# EAGLE design Ulimate (EAGLE 7.2.0)
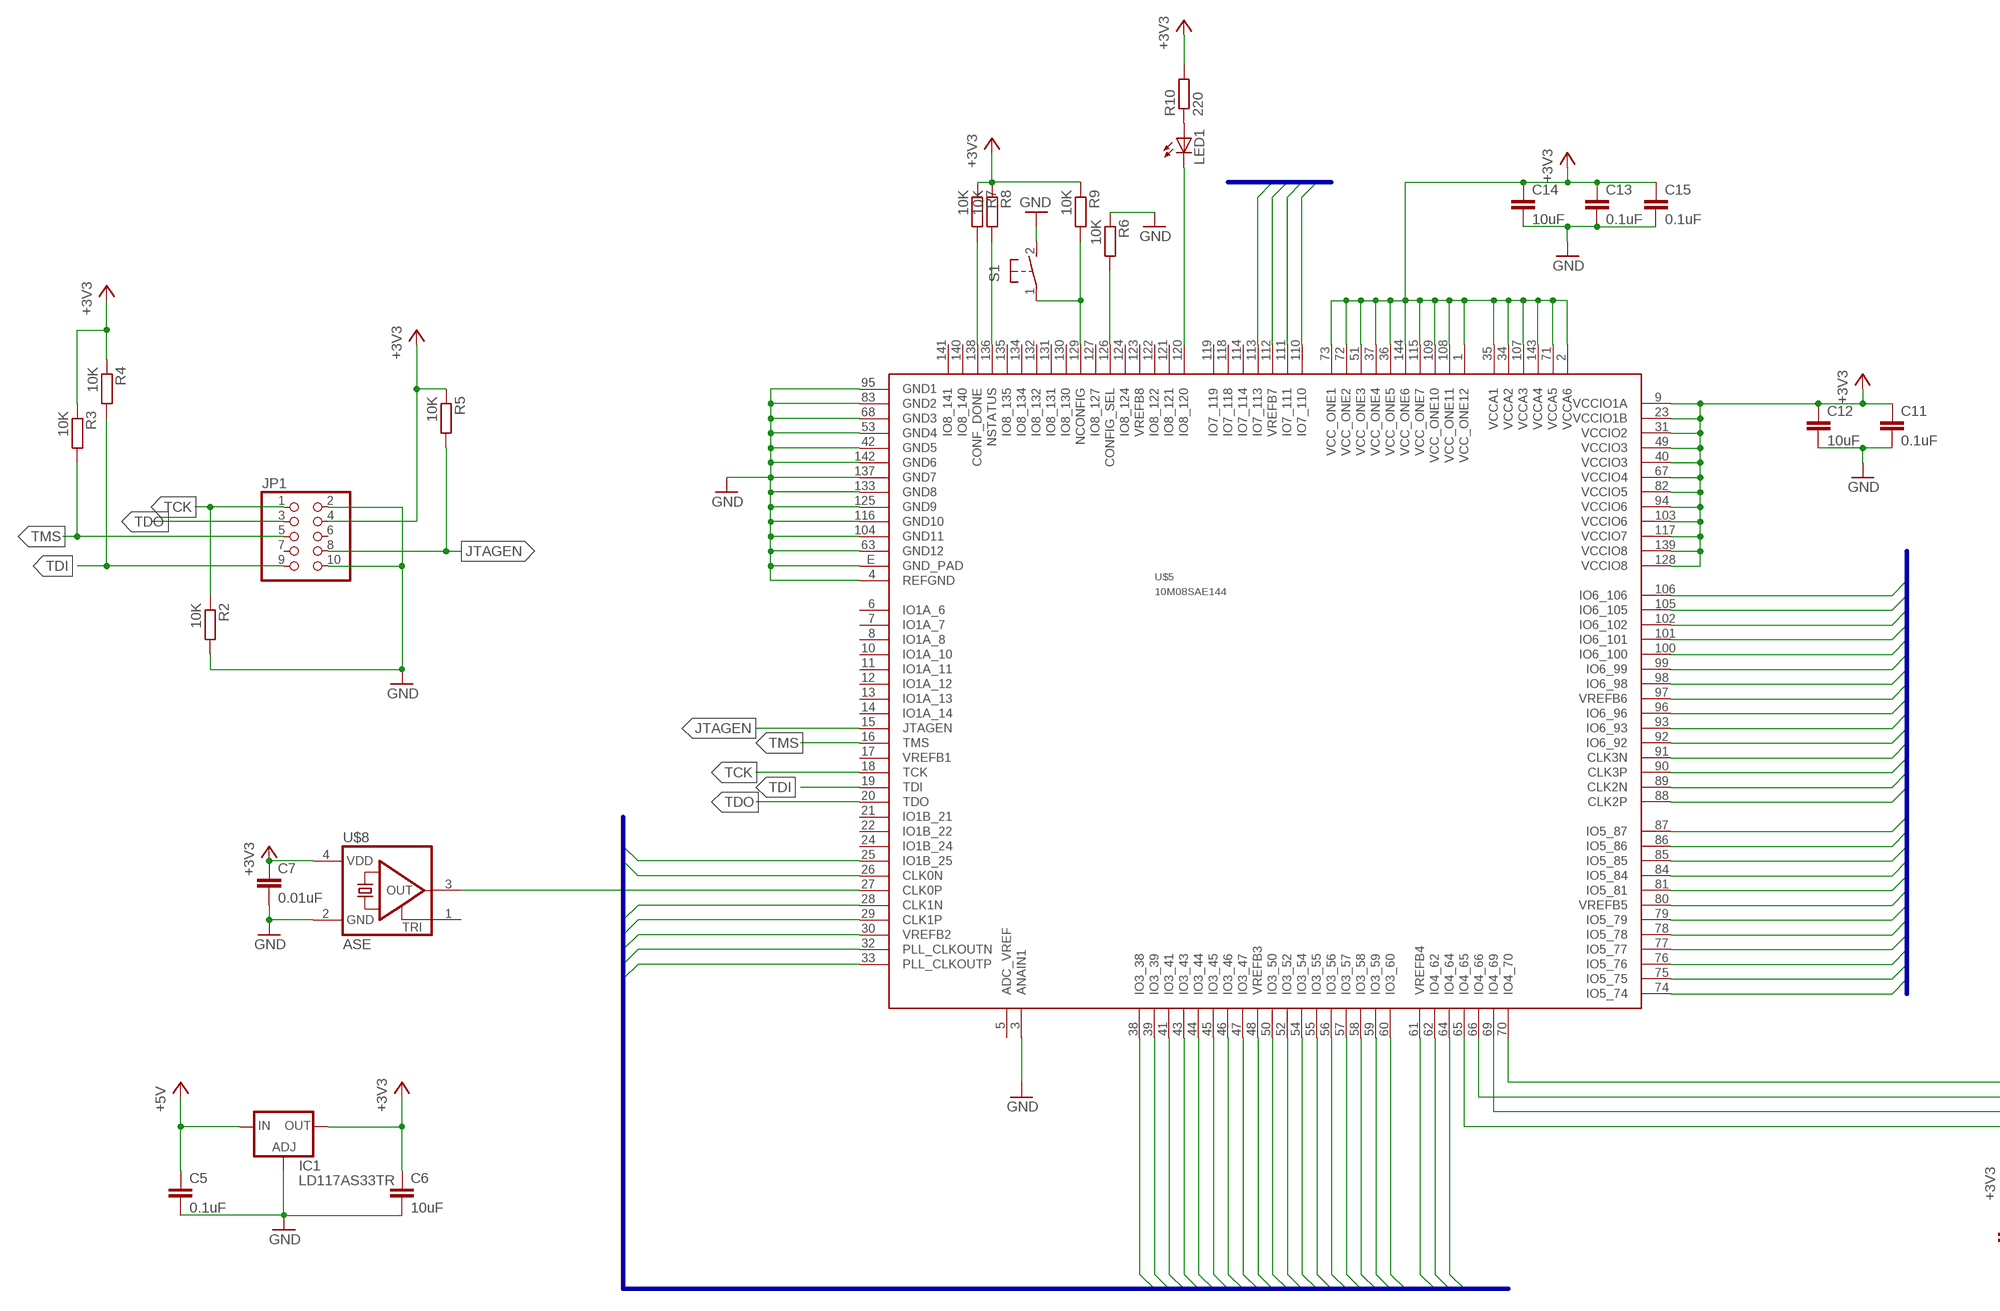
[diagram p0: schematic, sheet 1, part 1 of 2]
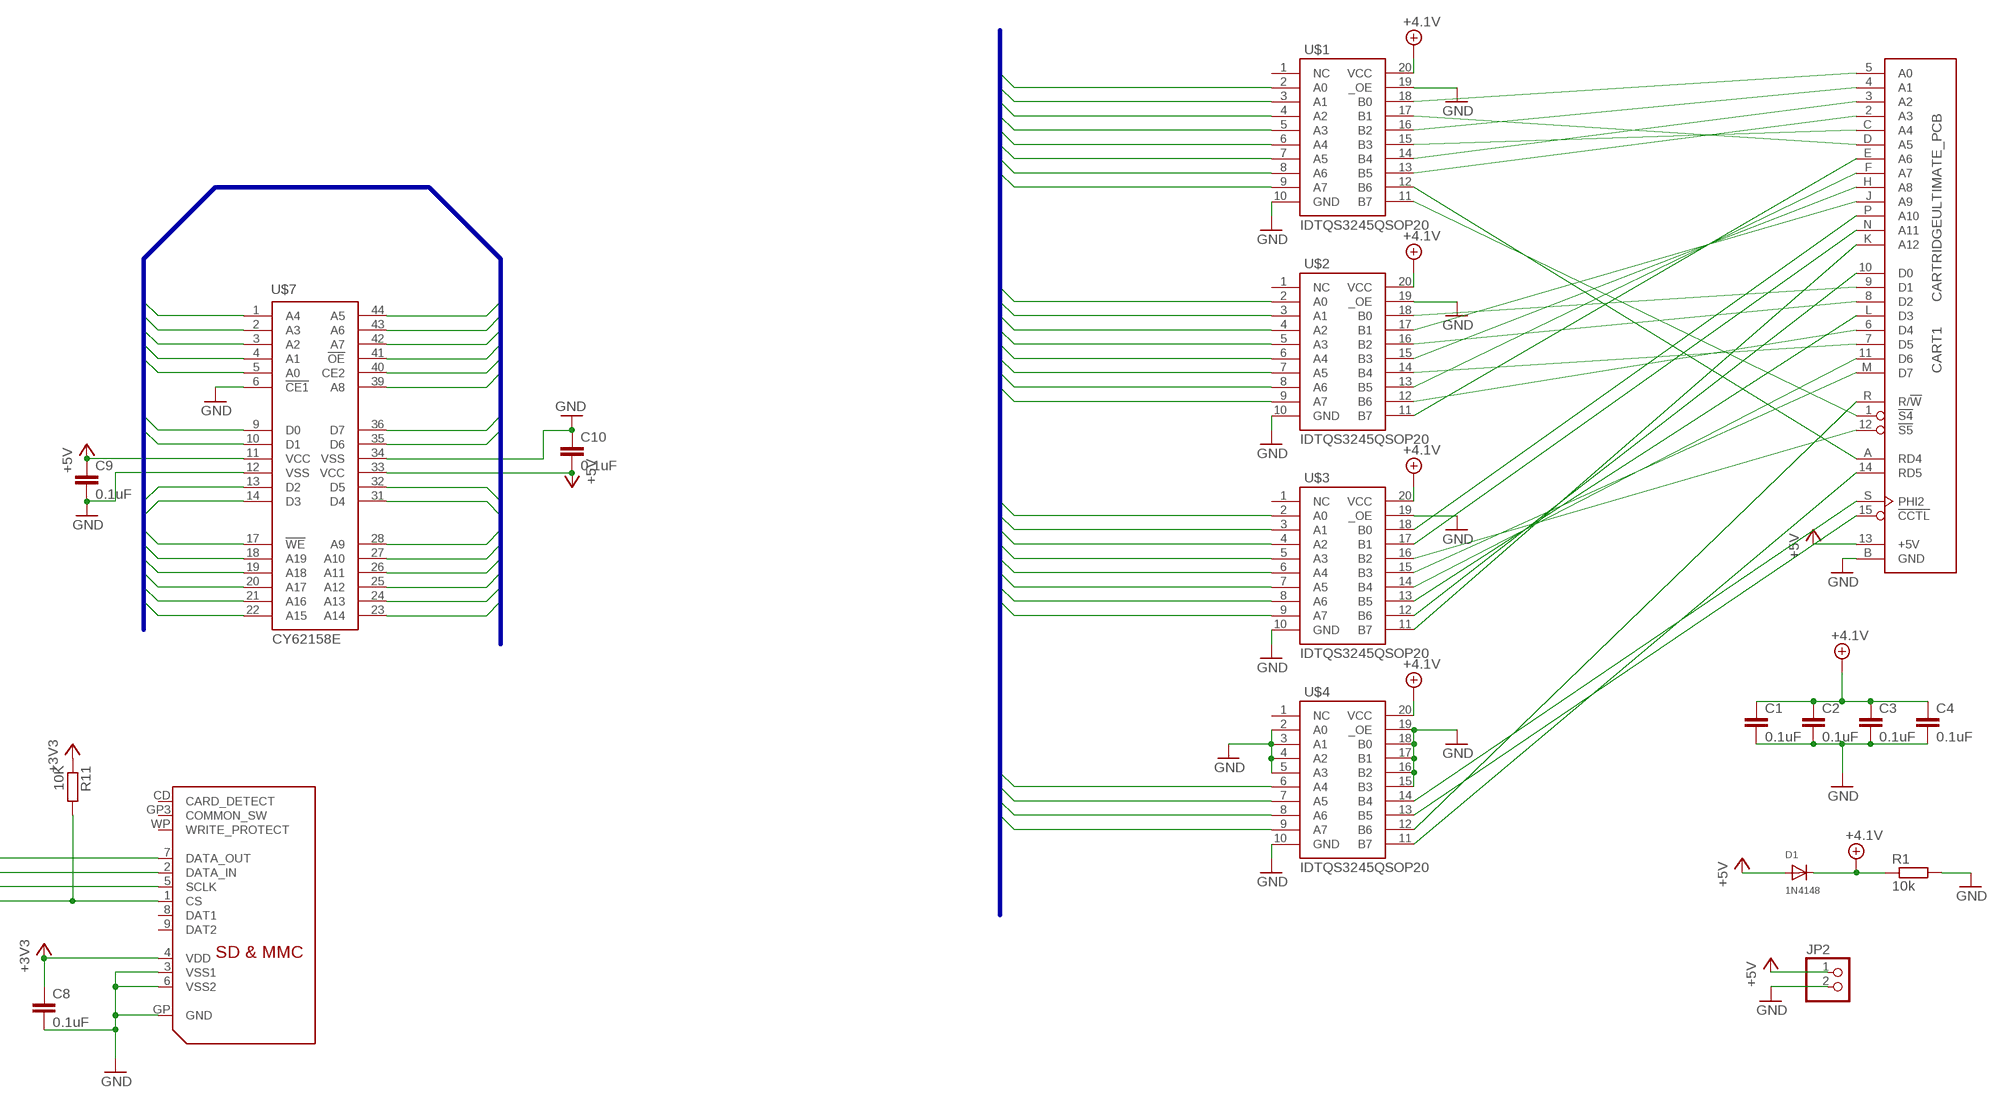
[diagram p1: schematic, sheet 1, part 2 of 2]

## Parts
C1  0.1uF  C-EUC0805K  [C0805K]
C2  0.1uF  C-EUC0805K  [C0805K]
C3  0.1uF  C-EUC0805K  [C0805K]
C4  0.1uF  C-EUC0805K  [C0805K]
C5  0.1uF  C-EUC0805K  [C0805K]
C6  10uF  C-EUC0805K  [C0805K]
C7  0.01uF  C-EUC0805K  [C0805K]
C8  0.1uF  C-EUC0805K  [C0805K]
C9  0.1uF  C-EUC0805K  [C0805K]
C10  0.1uF  C-EUC0805K  [C0805K]
C11  0.1uF  C-EUC0805K  [C0805K]
C12  10uF  C-EUC0805K  [C0805K]
C13  0.1uF  C-EUC0805K  [C0805K]
C14  10uF  C-EUC0805K  [C0805K]
C15  0.1uF  C-EUC0805K  [C0805K]
CART1  CARTRIDGEULTIMATE_PCB  [CART_ULTIMATE]
D1  1N4148  DIODE_SOD-123FL  [SOD-123FL]
IC1  LD117AS33TR  [SOT223]
JP1  PINHD-2X5  [2X05]
JP2  PINHD-1X2  [1X02]
LED1  LEDSML0805  [SML0805]
R1  10k  R-EU_R0805  [R0805]
R2  10K  R-EU_R0805  [R0805]
R3  10K  R-EU_R0805  [R0805]
R4  10K  R-EU_R0805  [R0805]
R5  10K  R-EU_R0805  [R0805]
R6  10K  R-EU_R0805  [R0805]
R7  10K  R-EU_R0805  [R0805]
R8  10K  R-EU_R0805  [R0805]
R9  10K  R-EU_R0805  [R0805]
R10  220  R-EU_R0805  [R0805]
R11  10K  R-EU_R0805  [R0805]
S1  31-XXSKINNY  [B3F-31XX-SKINNIER]
U$1  IDTQS3245QSOP20  [QSOP20]
U$2  IDTQS3245QSOP20  [QSOP20]
U$3  IDTQS3245QSOP20  [QSOP20]
U$4  IDTQS3245QSOP20  [QSOP20]
U$5  10M08SAE144  [EQFP144]
U$6  SDMMC06132  [06132]
U$7  CY62158E  [TSOP44-II]
U$8  ASE  [ASE]

## Nets
!OE: U$5.106(IO6_106) U$7.41(!OE)
!WE: U$5.89(CLK2N) U$7.17(!WE)
+3V3: C6.1 C7.1 C8.1 C11.1 C12.1 C13.1 C14.1 C15.1 IC1.4(OUT) JP1.4 R3.1 R4.1 R5.1 R7.1 R8.1 R9.1 R10.2 R11.1 U$5.1(VCC_ONE12) U$5.2(VCCA6) U$5.9(VCCIO1A) U$5.23(VCCIO1B) U$5.31(VCCIO2) U$5.34(VCCA2) U$5.35(VCCA1) U$5.36(VCC_ONE5) U$5.37(VCC_ONE4) U$5.40(VCCIO3) U$5.49(VCCIO3) U$5.51(VCC_ONE3) U$5.67(VCCIO4) U$5.71(VCCA5) U$5.72(VCC_ONE2) U$5.73(VCC_ONE1) U$5.82(VCCIO5) U$5.94(VCCIO6) U$5.103(VCCIO6) U$5.107(VCCA3) U$5.108(VCC_ONE11) U$5.109(VCC_ONE10) U$5.115(VCC_ONE7) U$5.117(VCCIO7) U$5.128(VCCIO8) U$5.139(VCCIO8) U$5.143(VCCA4) U$5.144(VCC_ONE6) U$6.4(VDD) U$8.4(VDD)
+4.1V: C1.1 C2.1 C3.1 C4.1 D1.C R1.1 U$1.20(VCC) U$2.20(VCC) U$3.20(VCC) U$4.20(VCC)
+5V: C5.1 C9.1 C10.2 CART1.13(+5V) D1.A IC1.3(IN) JP2.1 U$7.11(VCC) U$7.33(VCC)
A0: U$5.96(IO6_96) U$7.5(A0)
A1: U$5.97(VREFB6) U$7.4(A1)
A2: U$5.98(IO6_98) U$7.3(A2)
A3: U$5.99(IO6_99) U$7.2(A3)
A4: U$5.100(IO6_100) U$7.1(A4)
A5: U$5.105(IO6_105) U$7.44(A5)
A6: U$5.102(IO6_102) U$7.43(A6)
A7: U$5.101(IO6_101) U$7.42(A7)
A8: U$5.111(IO7_111) U$7.39(A8)
A9: U$5.76(IO5_76) U$7.28(A9)
A10: U$5.77(IO5_77) U$7.27(A10)
A11: U$5.78(IO5_78) U$7.26(A11)
A12: U$5.79(IO5_79) U$7.25(A12)
A13: U$5.80(VREFB5) U$7.24(A13)
A14: U$5.81(IO5_81) U$7.23(A14)
A15: U$5.84(IO5_84) U$7.22(A15)
A16: U$5.85(IO5_85) U$7.21(A16)
A17: U$5.86(IO5_86) U$7.20(A17)
A18: U$5.87(IO5_87) U$7.19(A18)
A19: U$5.88(CLK2P) U$7.18(A19)
CART_A0: U$1.2(A0) U$5.39(IO3_39)
CART_A1: U$1.4(A2) U$5.33(PLL_CLKOUTP)
CART_A2: U$1.6(A4) U$5.30(VREFB2)
CART_A3: U$1.7(A5) U$5.29(CLK1P)
CART_A4: U$1.5(A3) U$5.32(PLL_CLKOUTN)
CART_A5: U$1.3(A1) U$5.38(IO3_38)
CART_A6: U$2.9(A7) U$5.41(IO3_41)
CART_A7: U$2.7(A5) U$5.44(IO3_44)
CART_A8: U$2.5(A3) U$5.46(IO3_46)
CART_A9: U$2.3(A1) U$5.48(VREFB3)
CART_A10: U$3.2(A0) U$5.60(IO3_60)
CART_A11: U$3.3(A1) U$5.59(IO3_59)
CART_A12: U$3.9(A7) U$5.52(IO3_52)
CART_CTL: U$4.7(A5) U$5.64(IO4_64)
CART_D0: U$3.8(A6) U$5.54(IO3_54)
CART_D1: U$2.2(A0) U$5.50(IO3_50)
CART_D2: U$2.4(A2) U$5.47(IO3_47)
CART_D3: U$3.7(A5) U$5.55(IO3_55)
CART_D4: U$2.8(A6) U$5.43(IO3_43)
CART_D5: U$2.6(A4) U$5.45(IO3_45)
CART_D6: U$3.6(A4) U$5.56(IO3_56)
CART_D7: U$3.5(A3) U$5.57(IO3_57)
CART_PHI: U$4.6(A4) U$5.26(CLK0N)
CART_RD4: U$1.8(A6) U$5.25(IO1B_25)
CART_RD5: U$4.9(A7) U$5.61(VREFB4)
CART_RW: U$4.8(A6) U$5.62(IO4_62)
CART_S4: U$1.9(A7) U$5.28(CLK1N)
CART_S5: U$3.4(A2) U$5.58(IO3_58)
CE: U$5.110(IO7_110) U$7.40(CE2)
D0: U$5.93(IO6_93) U$7.9(D0)
D1: U$5.92(IO6_92) U$7.10(D1)
D2: U$5.91(CLK3N) U$7.13(D2)
D3: U$5.90(CLK3P) U$7.14(D3)
D4: U$5.75(IO5_75) U$7.31(D4)
D5: U$5.74(IO5_74) U$7.32(D5)
D6: U$5.113(IO7_113) U$7.35(D6)
D7: U$5.112(VREFB7) U$7.36(D7)
GND: C1.2 C2.2 C3.2 C4.2 C5.2 C6.2 C7.2 C8.2 C9.2 C10.1 C11.2 C12.2 C13.2 C14.2 C15.2 CART1.B(GND) IC1.1(ADJ) JP1.2 JP1.10 JP2.2 R1.2 R2.2 R6.1 S1.2(S) U$1.10(GND) U$1.19(_OE) U$2.10(GND) U$2.19(_OE) U$3.10(GND) U$3.19(_OE) U$4.2(A0) U$4.3(A1) U$4.4(A2) U$4.5(A3) U$4.10(GND) U$4.15(B3) U$4.16(B2) U$4.17(B1) U$4.18(B0) U$4.19(_OE) U$5.3(ANAIN1) U$5.4(REFGND) U$5.42(GND5) U$5.53(GND4) U$5.63(GND12) U$5.68(GND3) U$5.83(GND2) U$5.95(GND1) U$5.104(GND11) U$5.116(GND10) U$5.125(GND9) U$5.133(GND8) U$5.137(GND7) U$5.142(GND6) U$5.E(GND_PAD) U$6.3(VSS1) U$6.6(VSS2) U$6.GP(GND) U$7.6(!CE1) U$7.12(VSS) U$7.34(VSS) U$8.2(GND)
JTAGEN: JP1.8 R5.2 U$5.15(JTAGEN)
N$1: CART1.1(!S4) U$1.11(B7)
N$2: CART1.A(RD4) U$1.12(B6)
N$3: CART1.2(A3) U$1.13(B5)
N$4: CART1.3(A2) U$1.14(B4)
N$5: CART1.C(A4) U$1.15(B3)
N$6: CART1.4(A1) U$1.16(B2)
N$7: CART1.D(A5) U$1.17(B1)
N$8: CART1.5(A0) U$1.18(B0)
N$9: CART1.E(A6) U$2.11(B7)
N$10: CART1.6(D4) U$2.12(B6)
N$11: CART1.F(A7) U$2.13(B5)
N$12: CART1.7(D5) U$2.14(B4)
N$13: CART1.H(A8) U$2.15(B3)
N$14: CART1.8(D2) U$2.16(B2)
N$15: CART1.J(A9) U$2.17(B1)
N$16: CART1.9(D1) U$2.18(B0)
N$17: CART1.K(A12) U$3.11(B7)
N$18: CART1.10(D0) U$3.12(B6)
N$19: CART1.L(D3) U$3.13(B5)
N$20: CART1.11(D6) U$3.14(B4)
N$21: CART1.M(D7) U$3.15(B3)
N$22: CART1.12(!S5) U$3.16(B2)
N$23: CART1.N(A11) U$3.17(B1)
N$24: CART1.P(A10) U$3.18(B0)
N$25: CART1.14(RD5) U$4.11(B7)
N$26: CART1.R(R/!W) U$4.12(B6)
N$27: CART1.15(!CCTL) U$4.13(B5)
N$28: CART1.S(PHI2) U$4.14(B4)
N$29: U$5.27(CLK0P) U$8.3(OUT)
N$30: R6.2 U$5.126(CONFIG_SEL)
N$31: R7.2 U$5.138(CONF_DONE)
N$32: R8.2 U$5.136(NSTATUS)
N$33: R9.2 S1.1(P) U$5.129(NCONFIG)
N$34: LED1.A R10.1
N$35: LED1.C U$5.120(IO8_120)
SD_CLK: U$5.69(IO4_69) U$6.5(SCLK)
SD_CS: R11.2 U$5.65(IO4_65) U$6.1(CS)
SD_DI: U$5.66(IO4_66) U$6.2(DATA_IN)
SD_DO: U$5.70(IO4_70) U$6.7(DATA_OUT)
TCK: JP1.1 R2.1 U$5.18(TCK)
TDI: JP1.9 R4.2 U$5.19(TDI)
TDO: JP1.3 U$5.20(TDO)
TMS: JP1.5 R3.2 U$5.16(TMS)
Unconnected: JP1.6 JP1.7 U$1.1(NC) U$2.1(NC) U$3.1(NC) U$4.1(NC) U$5.5(ADC_VREF) U$5.6(IO1A_6) U$5.7(IO1A_7) U$5.8(IO1A_8) U$5.10(IO1A_10) U$5.11(IO1A_11) U$5.12(IO1A_12) U$5.13(IO1A_13) U$5.14(IO1A_14) U$5.17(VREFB1) U$5.21(IO1B_21) U$5.22(IO1B_22) U$5.24(IO1B_24) U$5.114(IO7_114) U$5.118(IO7_118) U$5.119(IO7_119) U$5.121(IO8_121) U$5.122(IO8_122) U$5.123(VREFB8) U$5.124(IO8_124) U$5.127(IO8_127) U$5.130(IO8_130) U$5.131(IO8_131) U$5.132(IO8_132) U$5.134(IO8_134) U$5.135(IO8_135) U$5.140(IO8_140) U$5.141(IO8_141) U$6.8(DAT1) U$6.9(DAT2) U$6.CD(CARD_DETECT) U$6.GP3(COMMON_SW) U$6.WP(WRITE_PROTECT) U$8.1(TRI)

## Buses
CART_D[0..7],CART_A[0..12],CART_S4,CART_S5,CART_RD4,CART_RD5,CART_RW,CART_PHI,CART_CTL
D[0..7],A[0..19],CE,!WE,!OE

## Library data of the parts
C1-C15 = rcl:C-EU: CAPACITOR, European symbol
CART1 = eagle-6.5.0-atari:CARTRIDGE: Cartridge
D1 = adafruit:DIODE: Diode SMADIODE - SMA Surface Mount Package 20V 1A Schottky Diode Digikey: 641-1014-6-ND DO-1N4148 - Through Hole Small Current Diode SOD-123 20V 1 A (.5mV Vf) Schottky Diode - Digikey: MBRX120TPMSCT-ND SOD-323 10V 570mA (.38mV Vf, 3ns) Schottky Diode - Digikey: ZLLS410CT-ND SOD-523 30V 30mA Schottky Diode (RB751S-40TE61) - Digikey: RB751S-40TE61CT-ND SOT23-R/W - SOT23 Package (R = Solder Paste/Reflow Ovens, W = Hand-Soldering) BAT54Film 40V 300mA - Digikey: 497-7162-1-ND
IC1 = v-reg:LD117A?*: Low drop fixed and adjustable positive voltage regulators 1 A Source: http://www.st.com/stonline/products/literature/ds/7194/ld1117axx.pdf
JP1 = pinhead:PINHD-2X5: PIN HEADER
JP2 = pinhead:PINHD-1X2: PIN HEADER
LED1 = led:LED: LED OSRAM: - CHIPLED LG R971, LG N971, LY N971, LG Q971, LY Q971, LO R971, LY R971 LH N974, LH R974 LS Q976, LO Q976, LY Q976 LO Q996 - Hyper CHIPLED LW Q18S LB Q993, LB Q99A, LB R99A - SideLED LS A670, LO A670, LY A670, LG A670, LP A670 LB A673, LV A673, LT A673, LW A673 LH A674 LY A675 LS A676, LA A676, LO A676, LY A676, LW A676 LS A679, LY A679, LG A679 - Hyper Micro SIDELED® LS Y876, LA Y876, LO Y876, LY Y876 LT Y87S - SmartLED LW L88C, LW L88S LB L89C, LB L89S, LG L890 LS L89K, LO L89K, LY L89K LS L896, LA L896, LO L896, LY L896 - TOPLED LS T670, LO T670, LY T670, LG T670, LP T670 LSG T670, LSP T670, LSY T670, LOP T670, LYG T670 LG T671, LOG T671, LSG T671 LB T673, LV T673, LT T673, LW T673 LH T674 LS T676, LA T676, LO T676, LY T676, LB T676, LH T676, LSB T676, LW T676 LB T67C, LV T67C, LT T67C, LS T67K, LO T67K, LY T67K, LW E67C LS E67B, LA E67B, LO E67B, LY E67B, LB E67C, LV E67C, LT E67C LW T67C LS T679, LY T679, LG T679 LS T770, LO T770, LY T770, LG T770, LP T770 LB T773, LV T773, LT T773, LW T773 LH T774 LS E675, LA E675, LY E675, LS T675 LS T776, LA T776, LO T776, LY T776, LB T776 LHGB T686 LT T68C, LB T68C - Hyper Mini TOPLED® LB M676 - Mini TOPLED Santana® LG M470 LS M47K, LO M47K, LY M47K Source: http://www.osram.convergy.de LUXEON: - LUMILED® LXK2-PW12-R00, LXK2-PW12-S00, LXK2-PW14-U00, LXK2-PW14-V00 LXK2-PM12-R00, LXK2-PM12-S00, LXK2-PM14-U00 LXK2-PE12-Q00, LXK2-PE12-R00, LXK2-PE12-S00, LXK2-PE14-T00, LXK2-PE14-U00 LXK2-PB12-K00, LXK2-PB12-L00, LXK2-PB12-M00, LXK2-PB14-N00, LXK2-PB14-P00, LXK2-PB14-Q00 LXK2-PR12-L00, LXK2-PR12-M00, LXK2-PR14-Q00, LXK2-PR14-R00 LXK2-PD12-Q00, LXK2-PD12-R00, LXK2-PD12-S00 LXK2-PH12-R00, LXK2-PH12-S00 LXK2-PL12-P00, LXK2-PL12-Q00, LXK2-PL12-R00 Source: www.luxeon.com KINGBRIGHT: KA-3528ASYC Source: www.kingbright.com
R1-R11 = resistor:R-EU_: RESISTOR, European symbol
S1 = adafruit:31-XX: OMRON SWITCH Now with beefier pads!
U$1-U$4 = IDTQS_3245QG:IDTQS3245
U$5 = 10M08SAE144:10M08SAE144
U$6 = adafruit:SDMMC: SD MMC Card holder 4UCON part #06132 - easy to solder
U$7 = CY62158E:CY62158E
U$8 = crystal:ASE: 3.3Vdc CMOS SMD CRYSTAL CLOCK OSCILLATOR SOurce: www.abracon.com; OC_FARNELL: unknown; OC_NEWARK: unknown

## Board
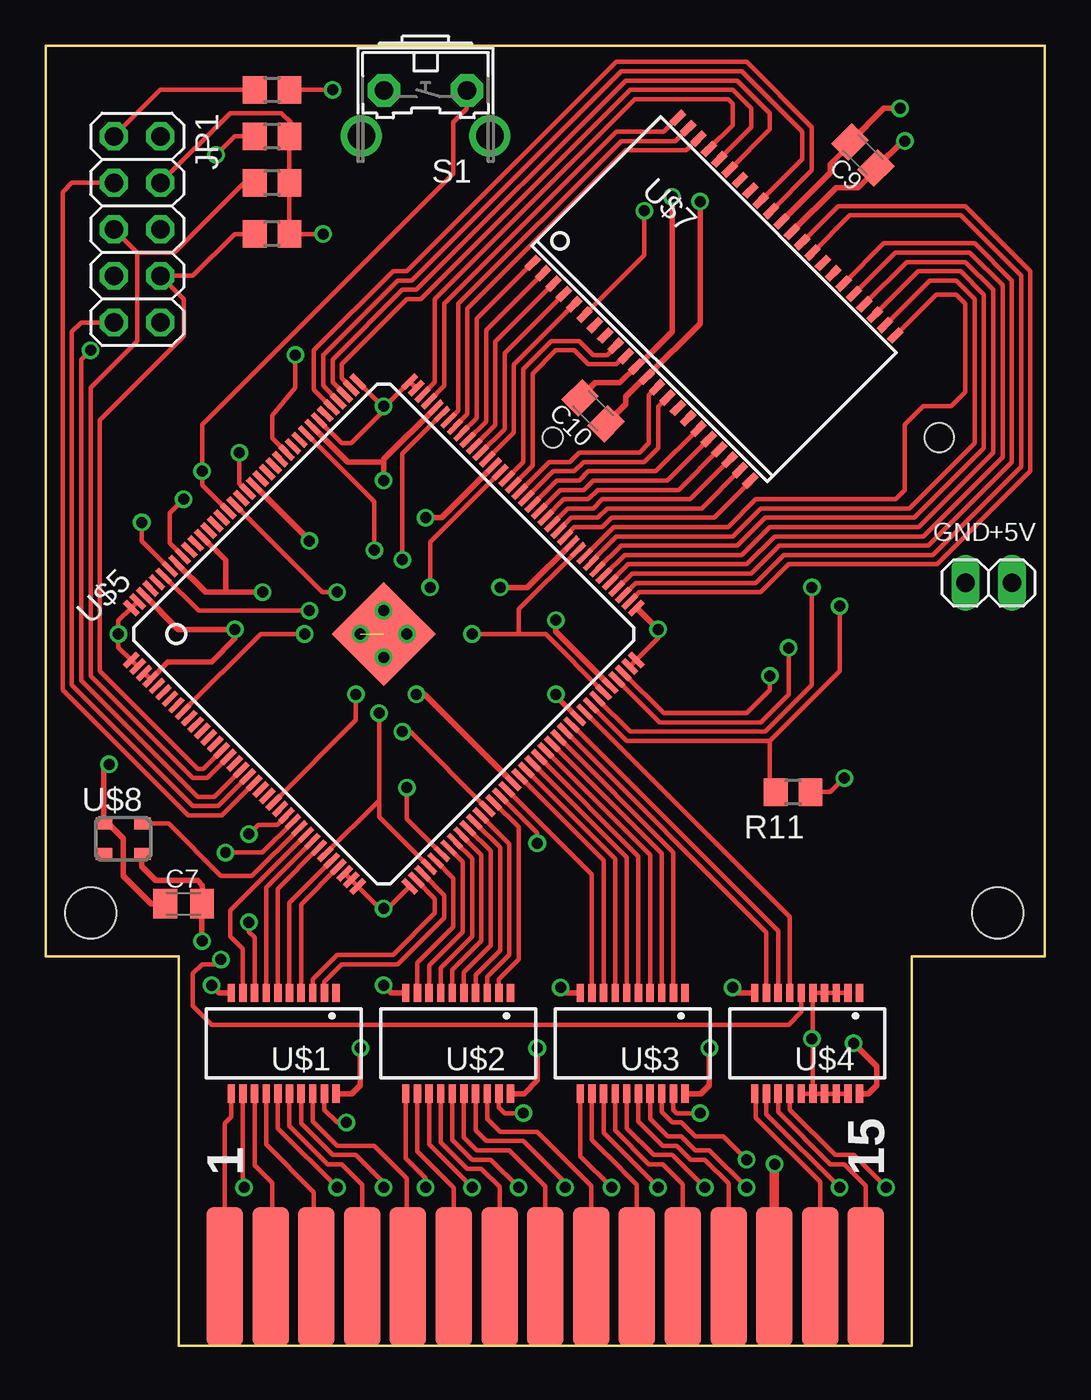
[diagram p2: board, top side]
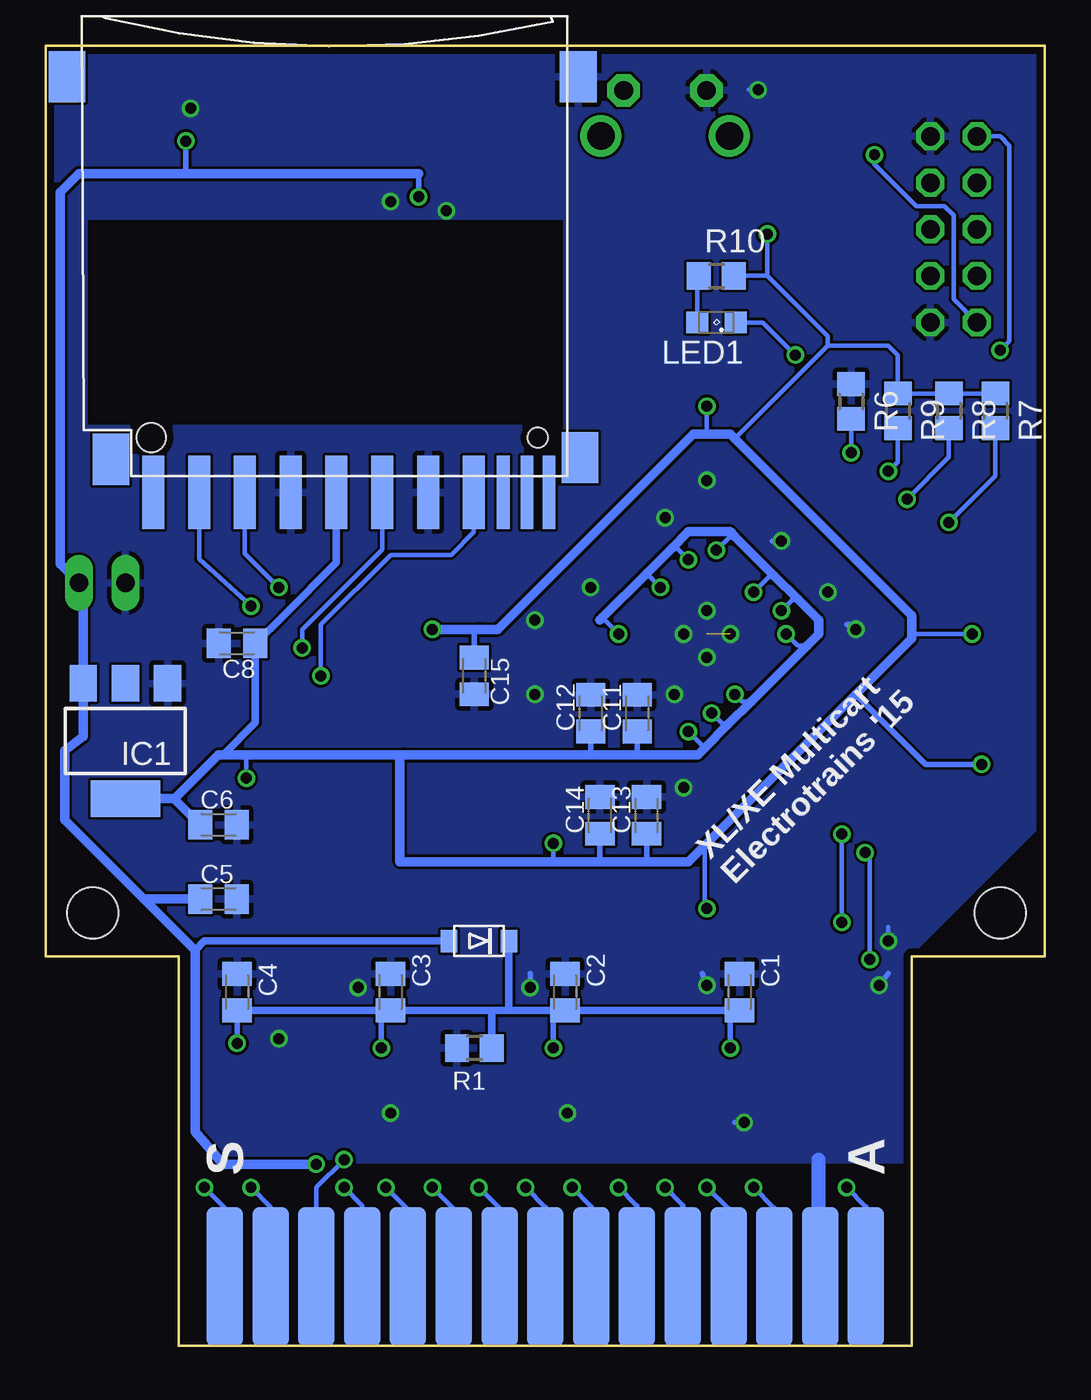
[diagram p3: board, bottom side, seen from below]

Size 54.54 x 70.98 mm. Coordinates in mm from the lower left corner, seen from the top.
Copper layers (1*16): Top 0.0356mm / dielectric 1.5011mm / Bottom 0.0356mm
Design rules "OSHPark2layer": minimum track width 6mil, minimum drill 13mil, track to track 6mil, track to pad 6mil, pad to pad 6mil, via to via 6mil, smd to smd 6mil, copper to edge 15mil, drill to drill 6mil, minimum pad ring 7mil, minimum via ring 7mil, stop-mask expansion 3mil, vias tented up to drill 0mil, thermal gap 10mil
Holes 2.8 mm at 2.44,23.62 51.97,23.62
bRestrict: area 26.3,50.3 to 52.2,61.5

### Footprints (pad centres in the part's own frame; a part is rotated, then mirrored left to right if it is on the bottom)
C0805K = smd 1.3 x 1.6: 1 -1,0; 2 1,0
CART_ULTIMATE = smd 2 x 7.62: 1 -17.82,-33.06; 2 -15.32,-33.06; 3 -12.82,-33.06; 4 -10.32,-33.06; 5 -7.82,-33.06; 6 -5.32,-33.06; 7 -2.82,-33.06; 8 -0.32,-33.06; 9 2.18,-33.06; 10 4.68,-33.06; 11 7.18,-33.06; 12 9.68,-33.06; 13 12.18,-33.06; 14 14.68,-33.06; 15 17.18,-33.06 | smd 2 x 7.62 bottom: A -17.82,-33.06; B -15.32,-33.06; C -12.82,-33.06; D -10.32,-33.06; E -7.82,-33.06; F -5.32,-33.06; H -2.82,-33.06; J -0.32,-33.06; K 2.18,-33.06; L 4.68,-33.06; M 7.18,-33.06; N 9.68,-33.06; P 12.18,-33.06; R 14.68,-33.06; S 17.18,-33.06
SOD-123FL = smd 0.91 x 1.22: A 1.637,0; C -1.637,0
SOT223 = smd 1.5 x 2: 1 -2.3,-3.15; 2 0,-3.15; 3 2.3,-3.15 | smd 3.8 x 2: 4 0,3.15
2X05 = drill 1.016 octagon: 1 -5.08,-1.27; 2 -5.08,1.27; 3 -2.54,-1.27; 4 -2.54,1.27; 5 0,-1.27; 6 0,1.27; 7 2.54,-1.27; 8 2.54,1.27; 9 5.08,-1.27; 10 5.08,1.27
1X02 = drill 1.016 long: 1 -1.27,0; 2 1.27,0
SML0805 = smd 1.2 x 1.2: A 1.05,0; C -1.05,0
R0805 = smd 1.3 x 1.5: 1 -0.95,0; 2 0.95,0
B3F-31XX-SKINNIER = drill 1.016 pad 1.778 octagon: 1 -2.261,-1.245; 2 2.261,-1.245 | drill 1.499 pad 2.032: 3 -3.505,1.245; 4 3.505,1.245
QSOP20 = smd 0.4 x 1: 1 -2.858,-2.75; 2 -2.223,-2.75; 3 -1.588,-2.75; 4 -0.953,-2.75; 5 -0.318,-2.75; 6 0.318,-2.75; 7 0.953,-2.75; 8 1.588,-2.75; 9 2.223,-2.75; 10 2.858,-2.75; 11 2.858,2.75; 12 2.223,2.75; 13 1.588,2.75; 14 0.953,2.75; 15 0.318,2.75; 16 -0.318,2.75; 17 -0.953,2.75; 18 -1.588,2.75; 19 -2.223,2.75; 20 -2.858,2.75
EQFP144 = smd 1 x 0.3: 1 -10.75,8.75; 2 -10.75,8.25; 3 -10.75,7.75; 4 -10.75,7.25; 5 -10.75,6.75; 6 -10.75,6.25; 7 -10.75,5.75; 8 -10.75,5.25; 9 -10.75,4.75; 10 -10.75,4.25; 11 -10.75,3.75; 12 -10.75,3.25; 13 -10.75,2.75; 14 -10.75,2.25; 15 -10.75,1.75; 16 -10.75,1.25; 17 -10.75,0.75; 18 -10.75,0.25; 19 -10.75,-0.25; 20 -10.75,-0.75; 21 -10.75,-1.25; 22 -10.75,-1.75; 23 -10.75,-2.25; 24 -10.75,-2.75; 25 -10.75,-3.25; 26 -10.75,-3.75; 27 -10.75,-4.25; 28 -10.75,-4.75; 29 -10.75,-5.25; 30 -10.75,-5.75; 31 -10.75,-6.25; 32 -10.75,-6.75; 33 -10.75,-7.25; 34 -10.75,-7.75; 35 -10.75,-8.25; 36 -10.75,-8.75; 73 10.75,-8.75; 74 10.75,-8.25; 75 10.75,-7.75; 76 10.75,-7.25; 77 10.75,-6.75; 78 10.75,-6.25; 79 10.75,-5.75; 80 10.75,-5.25; 81 10.75,-4.75; 82 10.75,-4.25; 83 10.75,-3.75; 84 10.75,-3.25; 85 10.75,-2.75; 86 10.75,-2.25; 87 10.75,-1.75; 88 10.75,-1.25; 89 10.75,-0.75; 90 10.75,-0.25; 91 10.75,0.25; 92 10.75,0.75; 93 10.75,1.25; 94 10.75,1.75; 95 10.75,2.25; 96 10.75,2.75; 97 10.75,3.25; 98 10.75,3.75; 99 10.75,4.25; 100 10.75,4.75; 101 10.75,5.25; 102 10.75,5.75; 103 10.75,6.25; 104 10.75,6.75; 105 10.75,7.25; 106 10.75,7.75; 107 10.75,8.25; 108 10.75,8.75 | smd 0.3 x 1: 37 -8.75,-10.75; 38 -8.25,-10.75; 39 -7.75,-10.75; 40 -7.25,-10.75; 41 -6.75,-10.75; 42 -6.25,-10.75; 43 -5.75,-10.75; 44 -5.25,-10.75; 45 -4.75,-10.75; 46 -4.25,-10.75; 47 -3.75,-10.75; 48 -3.25,-10.75; 49 -2.75,-10.75; 50 -2.25,-10.75; 51 -1.75,-10.75; 52 -1.25,-10.75; 53 -0.75,-10.75; 54 -0.25,-10.75; 55 0.25,-10.75; 56 0.75,-10.75; 57 1.25,-10.75; 58 1.75,-10.75; 59 2.25,-10.75; 60 2.75,-10.75; 61 3.25,-10.75; 62 3.75,-10.75; 63 4.25,-10.75; 64 4.75,-10.75; 65 5.25,-10.75; 66 5.75,-10.75; 67 6.25,-10.75; 68 6.75,-10.75; 69 7.25,-10.75; 70 7.75,-10.75; 71 8.25,-10.75; 72 8.75,-10.75; 109 8.75,10.75; 110 8.25,10.75; 111 7.75,10.75; 112 7.25,10.75; 113 6.75,10.75; 114 6.25,10.75; 115 5.75,10.75; 116 5.25,10.75; 117 4.75,10.75; 118 4.25,10.75; 119 3.75,10.75; 120 3.25,10.75; 121 2.75,10.75; 122 2.25,10.75; 123 1.75,10.75; 124 1.25,10.75; 125 0.75,10.75; 126 0.25,10.75; 127 -0.25,10.75; 128 -0.75,10.75; 129 -1.25,10.75; 130 -1.75,10.75; 131 -2.25,10.75; 132 -2.75,10.75; 133 -3.25,10.75; 134 -3.75,10.75; 135 -4.25,10.75; 136 -4.75,10.75; 137 -5.25,10.75; 138 -5.75,10.75; 139 -6.25,10.75; 140 -6.75,10.75; 141 -7.25,10.75; 142 -7.75,10.75; 143 -8.25,10.75; 144 -8.75,10.75 | smd 4 x 4: E 0,0
06132 = smd 1.2 x 4: 1 6.9,0.9; 2 4.4,0.9; 3 1.9,0.9; 4 -0.6,0.9; 5 -3.1,0.9; 6 -5.6,0.9; 7 -8.1,0.9; 9 9.4,0.9 | smd 0.7 x 4: 8 -9.7,0.9; CD -11,0.9; WP -12.2,0.9 | smd 2 x 2.8: GP -13.8,-21.8; GP2 14.1,-21.8; GP3 11.7,-0.9; GP4 -13.9,-1 | hole 1.1: -11.6,-2.1 | hole 1.6: 9.5,-2.1
TSOP44-II = smd 0.4 x 0.9: 1 -8.4,-5.6; 2 -7.6,-5.6; 3 -6.8,-5.6; 4 -6,-5.6; 5 -5.2,-5.6; 6 -4.4,-5.6; 7 -3.6,-5.6; 8 -2.8,-5.6; 9 -2,-5.6; 10 -1.2,-5.6; 11 -0.4,-5.6; 12 0.4,-5.6; 13 1.2,-5.6; 14 2,-5.6; 15 2.8,-5.6; 16 3.6,-5.6; 17 4.4,-5.6; 18 5.2,-5.6; 19 6,-5.6; 20 6.8,-5.6; 21 7.6,-5.6; 22 8.4,-5.6; 23 8.4,5.6; 24 7.6,5.6; 25 6.8,5.6; 26 6,5.6; 27 5.2,5.6; 28 4.4,5.6; 29 3.6,5.6; 30 2.8,5.6; 31 2,5.6; 32 1.2,5.6; 33 0.4,5.6; 34 -0.4,5.6; 35 -1.2,5.6; 36 -2,5.6; 37 -2.8,5.6; 38 -3.6,5.6; 39 -4.4,5.6; 40 -5.2,5.6; 41 -6,5.6; 42 -6.8,5.6; 43 -7.6,5.6; 44 -8.4,5.6
ASE = smd 0.9 x 0.65: 1 -1.05,-0.825; 2 1.05,-0.825; 3 1.05,0.825; 4 -1.05,0.825

### Placement (x,y rotation side)
C1  16.67,19.3 90 bottom
C2  26.19,19.3 90 bottom
C3  35.72,19.3 90 bottom
C4  44.1,19.3 90 bottom
C5  45.12,24.38 0 bottom
C6  45.12,28.45 0 bottom
C7  7.52,24.13 0 top
C8  44.1,38.35 180 bottom
C9  44.61,65.02 135 top
C10  29.88,51.05 135 top
C11  22.26,34.54 90 bottom
C12  24.8,34.54 90 bottom
C13  21.75,28.96 90 bottom
C14  24.29,28.96 90 bottom
C15  31.15,36.58 270 bottom
CART1  27.59,36.83 0 top
D1  30.89,22.1 180 bottom
IC1  50.2,33.02 180 bottom
JP1  4.98,60.96 270 top
JP2  51.47,41.66 180 top
LED1  17.94,55.88 180 bottom
R1  31.15,16.26 180 bottom
R2  12.35,68.58 0 top
R3  12.35,63.5 180 top
R4  12.35,66.04 180 top
R5  12.35,60.71 180 top
R6  10.57,51.56 270 bottom
R7  2.7,51.05 270 bottom
R8  5.24,51.05 270 bottom
R9  8.03,51.05 270 bottom
R10  17.94,58.42 0 bottom
R11  40.8,30.23 180 top
S1  20.73,67.31 180 top
U$1  12.98,16.51 180 top
U$2  22.51,16.51 180 top
U$3  32.03,16.51 180 top
U$4  41.56,16.51 180 top
U$5  18.45,38.86 45 top
U$6  39.27,47.5 180 bottom
U$7  36.48,57.15 315 top
U$8  4.22,27.69 0 top

### Tracks (layer width: path | path; a pad name or v marks a point on that pad's centre or on a via)
!OE
  Top 0.254: U$7.41 37.5,66.65 37.5,67.82 37.24,68.07 32.16,68.07 21.24,57.15 21.24,53.09 21.24,52.83 21.24,52.62 U$5.106 20.48,51.85
!WE
  Top 0.254: U$7.17 33.3,47.75 29.62,47.75 29.11,47.24 27.89,47.24 U$5.89
+3V3  (via drill 0.6)
  Top 0.254: U$5.67 27.28,38.86 25.81,38.86 | 25.81,38.86 v23.27,38.86 | U$5.49 19.89,33.53 v19.46,33.53 | U$5.40 18.19,28.86 18.19,29.72 | 18.19,29.72 v18.19,34.54 | U$5.31 18.14,29.72 18.19,29.72 | U$5.23 16.92,34.16 v16.92,35.56 | U$5.9 11.73,38.86 v14.13,38.86 | U$5.139 8.34,40.13 v14.38,40.13 | U$5.128 15.1,41.15 v15.91,41.15 | U$5.117 17.94,46.09 v17.94,43.43 | U$5.103 19.46,48.72 v19.46,42.93 | U$5.94 20.99,43.88 v20.99,41.4 | U$5.82 25.81,40.22 25.81,38.86 | U$5.72 U$5.71 33.43,38.64 v33.43,39.12 | U$5.51 26.83,28 v26.83,27.43 | U$5.37 18.66,23.88 v18.45,23.88 18.23,23.88 U$5.36 U$5.35 U$5.34 | U$5.2 U$5.1 3.97,38.14 v3.97,38.86 3.97,39.59 U$5.144 U$5.143 | U$5.107 U$5.108 18.52,51.31 v18.45,51.31 | U$5.109 18.37,51.31 v18.45,51.31 | U$5.115 16.16,49.28 16.67,49.28 18.45,51.05 v18.45,51.31 | R11.1 42.83,30.23 v43.59,30.99 | v15.14,60.71 R5.1 R3.1 R4.1 13.37,66.11 13.37,66.8 12.86,67.31 10.06,67.31 JP1.4
  Top 0.305: U$5.73 32.27,40.28 v33.43,39.12 | C7.1 5.75,24.13 4.22,25.65 4.22,27.69 3.4,28.51 U$8.4 3.17,31.46 v3.46,31.75
  Bottom 0.254: v23.27,38.86 24.16,39.75 | v19.46,33.53 18.57,32.64 | v18.19,34.54 17.56,33.91 17.3,33.91 | v16.92,35.56 16.54,35.18 16.03,35.18 | v14.13,38.86 13.49,38.23 12.98,38.23 | v14.38,40.13 13.75,40.77 13.49,40.77 | v15.91,41.15 15.02,42.04 14.76,42.04 | v17.94,43.43 17.18,44.2 16.92,44.2 | v19.46,42.93 20.1,43.56 20.35,43.56 | v20.99,41.4 21.75,42.16 | v26.83,27.43 26.83,26.42 | v18.45,23.88 18.57,24 18.57,27.3 | v3.97,38.86 7.27,38.86 | v18.45,51.31 18.45,49.78 18.19,49.78 | 31.15,39.12 30.89,39.12 | R7.1 R8.1 R9.1 8.03,54.1 8.54,54.61 11.84,54.61 | v43.59,30.99 43.59,32 43.85,32.26 | 16.92,49.53 11.84,54.61 | 11.84,54.61 11.84,55.12 15.14,58.42 | 15.14,58.42 R10.2 | 15.14,58.42 v15.14,60.71
  Bottom 0.305: C11.1 22.26,32.26 22.51,32.26 | C12.1 24.8,32.26 24.54,32.26 | 35.21,32 34.96,32.26 | C13.1 21.75,26.42 | C14.1 24.29,26.42 | C15.1 31.15,39.12 | v3.46,31.75 6.51,31.75 10.32,35.56
  Bottom 0.406: U$6.4 38.67,42.76 41.56,39.88 C8.1 43.1,34.02 44.86,32.26
  Bottom 0.508: IC1.4 47.5,29.87 | 47.5,29.87 45.12,32.26 44.86,32.26 43.85,32.26 34.96,32.26 24.54,32.26 22.51,32.26 18.95,32.26 18.57,32.64 17.3,33.91 16.03,35.18 12.98,38.23 12.35,38.86 12.35,39.62 13.49,40.77 14.76,42.04 16.92,44.2 17.18,44.45 19.46,44.45 20.35,43.56 21.75,42.16 24.16,39.75 24.29,39.62 | 47.5,29.87 47.5,29.84 C6.1 | v33.43,39.12 30.89,39.12 29.88,39.12 19.21,49.78 18.19,49.78 17.18,49.78 16.92,49.53 7.27,39.88 7.27,38.86 7.27,38.61 10.32,35.56 18.57,27.3 19.46,26.42 21.75,26.42 24.29,26.42 26.83,26.42 35.21,26.42 35.21,32
+4.1V  (via drill 0.6)
  Top 0.305: U$1.20 16.71,13.76 17.18,14.22 v17.18,16.26 | U$2.20 26.11,13.76 26.83,14.48 v26.83,16.26 | U$3.20 35.76,13.76 36.23,14.22 v36.23,16.26 | U$4.20 44.91,13.76 45.37,14.22 45.37,15.24 v44.1,16.51
  Bottom 0.305: v26.83,16.26 26.83,18.68 C2.1 | v44.1,16.51 C4.1 | v17.18,16.26 17.18,18.3 | v36.23,16.26 36.23,18.3
  Bottom 0.406: 30.13,18.3 C3.1 36.23,18.3 C4.1 | 30.13,18.3 29.11,18.3 | 29.11,18.3 C2.1 17.18,18.3 C1.1 | R1.1 30.2,18.24 30.13,18.3 | D1.C 29.25,18.44 29.11,18.3
+5V  (via drill 0.6)
  Top 0.305: U$7.33 43.14,63.25 44.35,63.25 45.31,64.21 C9.1 46.78,65.79 v46.89,65.79 | C10.2 29.99,52.58 31.34,52.58 U$7.11 32.3,53.47 34.19,55.37 v34.19,62.74
  Top 0.508: CART1.13 39.77,9.89 v39.78,9.91
  Bottom 0.305: v46.89,65.79 46.89,64.01 | v34.19,62.74 34.19,64.01
  Bottom 0.406: D1.A 45.88,22.1 46.39,21.59
  Bottom 0.508: v39.78,9.91 44.86,9.91 46.39,11.68 46.39,21.59 49.18,24.38 | 49.18,24.38 53.5,28.7 53.5,32.51 52.5,33.26 IC1.3 52.5,41.39 JP2.1 53.75,42.67 53.75,62.99 52.74,64.01 46.89,64.01 34.19,64.01 | C5.1 49.18,24.38
A0
  Top 0.254: U$5.96 25.56,49.86 25.56,53.58 U$7.5
A1
  Top 0.254: U$5.97 25.05,50.06 25.05,54.2 U$7.4
A2
  Top 0.254: U$5.98 24.54,50.26 24.54,54.1 24.54,54.61 24.54,54.83 U$7.3
A3
  Top 0.254: U$5.99 24.03,50.46 24.03,54.36 24.03,54.86 24.03,55.45 U$7.2
A4
  Top 0.254: U$5.100 23.53,50.66 23.53,56.07 U$7.1
A5
  Top 0.254: U$5.105 21.75,52.42 21.75,52.83 21.75,53.34 21.75,56.9 31.15,66.29 33.75,66.29 U$7.44
A6
  Top 0.254: U$7.43 34.37,65.79 31.4,65.79 22.51,56.9 22.51,53.34 22.51,52.32 22.51,51.06 U$5.102
A7
  Top 0.254: U$5.101 23.02,50.86 23.02,53.09 23.02,53.59 23.02,56.64 31.65,65.28 34.96,65.28 35.6,65.92 U$7.42
A8
  Top 0.254: U$7.39 39.53,66.42 39.53,67.31 37.75,69.09 31.65,69.09 20.22,57.66 19.46,57.66 15.65,53.85 15.65,52.58 15.69,52.58 U$5.111
A9
  Top 0.254: U$7.28 45.75,60.2 50.7,60.2 52.74,58.17 52.74,48.26 48.16,43.69 40.04,43.69 38.51,42.16 32,42.16 U$5.76
A10
  Top 0.254: U$7.27 46.37,59.69 50.45,59.69 52.23,57.91 52.23,48.51 47.91,44.2 39.78,44.2 38.26,42.67 31.8,42.67 U$5.77
A11
  Top 0.254: U$7.26 47,59.18 50.2,59.18 51.72,57.66 51.72,48.77 47.66,44.7 39.53,44.7 38,43.18 31.6,43.18 U$5.78
A12
  Top 0.254: U$7.25 47.62,58.67 49.94,58.67 51.21,57.4 51.21,49.02 47.4,45.21 39.27,45.21 37.75,43.69 31.4,43.69 U$5.79
A13
  Top 0.254: U$7.24 48.24,58.17 49.69,58.17 50.7,57.15 50.7,49.28 47.15,45.72 39.02,45.72 37.5,44.2 31.15,44.2 29.88,42.93 29.88,42.87 U$5.80
A14
  Top 0.254: U$7.23 48.61,57.4 49.69,57.4 50.2,56.9 50.2,52.07 49.43,51.31 47.91,51.31 46.89,50.29 46.89,46.74 46.39,46.23 38.77,46.23 37.24,44.7 31.01,44.7 U$5.81
A15
  Top 0.254: U$5.84 28.34,44.19 28.86,44.7 30.38,44.7 30.89,45.21 36.48,45.21 38.46,47.19 U$7.22
A16
  Top 0.254: U$7.21 35.8,45.72 30.64,45.72 30.13,45.21 28.68,45.21 U$5.85
A17
  Top 0.254: U$7.20 35.17,46.23 30.38,46.23 29.88,45.72 28.49,45.72 U$5.86
A18
  Top 0.254: U$7.19 34.55,46.74 30.13,46.74 29.62,46.23 28.29,46.23 U$5.87
A19
  Top 0.254: U$7.18 33.93,47.24 29.88,47.24 29.37,46.74 28.09,46.74 U$5.88
CART_A0
  Top 0.254: U$5.39 21.75,24.6 21.75,23.37 19.21,20.83 16.16,20.83 15.21,19.88 U$1.2
CART_A1
  Top 0.254: U$5.33 13.94,24.1 U$1.4
CART_A2
  Top 0.254: U$5.30 12.67,24.95 U$1.6
CART_A3
  Top 0.254: U$5.29 12.03,25.02 U$1.7
CART_A4
  Top 0.254: U$5.32 13.3,24.17 U$1.5
CART_A5
  Top 0.254: U$5.38 21.24,24.4 21.24,23.62 18.95,21.34 15.91,21.34 14.57,20 U$1.3
CART_A6
  Top 0.254: U$5.41 22.26,25.51 22.26,22.86 20.29,20.89 U$2.9
CART_A7
  Top 0.254: U$5.44 23.27,26.61 23.27,22.35 21.56,20.64 U$2.7
CART_A8
  Top 0.254: U$5.46 24.29,27.01 24.29,21.84 22.83,20.38 U$2.5
CART_A9
  Top 0.254: U$5.48 25.3,27.41 25.3,21.34 24.1,20.13 U$2.3
CART_A10
  Top 0.254: U$3.2 34.26,26.94 U$5.60
CART_A11
  Top 0.254: U$3.3 33.62,26.87 U$5.59
CART_A12
  Top 0.254: U$3.9 29.81,25.73 U$5.52
CART_CTL
  Top 0.254: U$4.7 40.61,23.42 U$5.64
CART_D0
  Top 0.254: U$3.8 30.45,26.51 U$5.54
CART_D1
  Top 0.254: U$5.50 25.81,28.31 25.81,21.08 24.73,20 U$2.2
CART_D2
  Top 0.254: U$5.47 24.8,27.21 24.8,21.59 23.46,20.26 U$2.4
CART_D3
  Top 0.254: U$3.7 31.08,26.58 U$5.55
CART_D4
  Top 0.254: U$5.43 22.76,26.41 22.76,22.61 20.92,20.76 U$2.8
CART_D5
  Top 0.254: U$5.45 23.78,26.81 23.78,22.1 22.19,20.51 U$2.6
CART_D6
  Top 0.254: U$3.6 31.72,26.65 U$5.56
CART_D7
  Top 0.254: U$3.5 32.35,26.72 U$5.57
CART_PHI  (via drill 0.6)
  Top 0.254: U$4.6 41.24,18.22 40.54,17.53 9.05,17.53 8.03,18.54 8.03,20.32 8.54,20.83 9.3,20.83 v9.56,21.08 | U$5.26 11.81,26.92 v9.81,26.92
  Bottom 0.254: v9.56,21.08 9.56,26.67 v9.81,26.92
CART_RD4  (via drill 0.6)
  Top 0.254: U$1.8 11.4,22.29 11.08,22.61 v11.08,23.11 | v11.08,27.94 11.59,28.45 12.63,28.45 U$5.25
  Bottom 0.254: v11.08,23.11 v11.08,27.94
CART_RD5
  Top 0.254: U$4.9 39.34,22.57 U$5.61
CART_RW
  Top 0.254: U$4.8 39.97,22.64 U$5.62
CART_S4
  Top 0.254: U$1.9 10.76,21.65 10.06,22.35 10.06,23.76 U$5.28
CART_S5
  Top 0.254: U$3.4 32.99,26.79 U$5.58
CE
  Top 0.254: U$7.40 38.51,66.54 38.51,67.56 37.5,68.58 31.91,68.58 20.48,57.15 19.72,57.15 16.16,53.59 16.16,52.83 16.68,52.31 U$5.110
D0
  Top 0.254: U$5.93 26.07,48.25 26.07,53.34 27.59,54.86 29.11,54.86 29.88,54.1 30.64,54.1 31.11,54.57 U$7.9
D1
  Top 0.254: U$5.92 26.57,48.05 26.57,53.09 27.84,54.36 28.86,54.36 29.62,53.59 31.15,53.59 31.59,54.04 U$7.10
D2
  Top 0.254: U$7.13 32.92,51.9 32.92,49.28 32.42,48.77 29.11,48.77 28.61,48.26 27.49,48.26 U$5.91
D3
  Top 0.254: U$7.14 33.43,51.27 33.43,49.02 32.67,48.26 29.37,48.26 28.86,47.75 27.69,47.75 U$5.90
D4
  Top 0.254: U$7.31 43.88,61.72 49.94,61.72 53.24,58.42 53.24,48.01 48.42,43.18 40.29,43.18 38.77,41.66 32.2,41.66 U$5.75
D5
  Top 0.254: U$7.32 43.26,62.23 50.2,62.23 53.75,58.67 53.75,47.75 48.67,42.67 40.54,42.67 39.02,41.15 32.4,41.15 U$5.74
D6
  Top 0.254: U$7.35 41.81,64.18 41.81,66.55 38.26,70.1 31.15,70.1 19.72,58.67 18.95,58.67 14.64,54.36 14.64,52.22 U$5.113
D7
  Top 0.254: U$7.36 41.31,64.8 41.31,66.29 38,69.6 31.4,69.6 19.97,58.17 19.21,58.17 15.14,54.1 15.14,52.42 U$5.112
GND  (via drill 0.6)  (1 unrouted)
  Top 0.254: U$1.19 15.21,12.89 15.91,12.19 v16.41,12.19 | U$2.19 24.73,13.02 25.05,12.7 v26.07,12.7 | U$3.19 34.26,12.89 34.45,12.7 v35.72,12.7 | U$4.16 U$4.17 U$4.18 U$4.19 | U$4.16 U$4.15 | U$4.2 U$4.3 U$4.4 U$4.5 41.88,16.83 v41.81,16.76 41.88,16.7 U$4.16 | U$5.42 19.72,28.75 v19.72,30.48 | U$7.6 32.67,59.56 v32.67,61.98 | R2.2 v15.65,68.58 | U$5.4 U$5.3
  Top 0.305: U$2.10 18.87,19.26 v18.45,19.68 | U$1.10 9.47,19.26 v9.05,19.68 | U$3.10 28.4,19.26 v28.1,19.56 | U$4.10 37.79,19.26 v37.5,19.56 | U$7.34 42.83,64.07 42.83,64.52 43.9,65.59 C9.2 45.73,67.56 v46.64,67.56 | v35.72,62.48 35.72,55.82 U$7.12 32.74,52.91 31.65,51.82 31.65,51.42 C10.1 | U$5.53 20.69,35.56 v20.22,35.56 | U$5.63 27.84,35.47 v27.84,35.56 | U$5.68 27.84,39.01 v27.84,39.62 | U$5.83 26.29,41.4 v24.8,41.4 | U$5.95 21.61,45.21 v20.73,45.21 | U$5.104 18.45,48.41 18.45,48.26 | 18.45,48.26 v18.45,47.24 | U$5.116 16.47,48.26 18.45,48.26 | U$5.125 14.38,43.99 v14.38,43.94 | U$5.137 8.73,41.15 9.81,41.15 | 9.81,41.15 v11.84,41.15 | U$5.133 9.81,42.9 9.81,41.15 | U$5.142 7.23,39.12 v10.32,39.12 10.32,38.61 9.05,37.34 6.67,37.34 U$5.4 | v8.54,22.1 8.52,22.11 C7.2 8.54,24.4 8.54,25.15 8.29,25.4 6,25.4 5.24,26.16 5.24,26.83 U$8.2
  Bottom 0.254: v35.72,12.7 35.97,12.7 | v41.81,16.76 41.81,16.51 | v19.72,30.48 19.72,30.73 | v8.54,22.1 8.54,22.86 | v32.67,61.98 32.67,62.23 | v15.65,68.58 16.16,68.58
  Bottom 0.305: v18.45,19.68 18.7,20.32 | v9.05,19.68 8.54,20.32 | v28.1,19.56 28.1,20.32 | v37.5,19.56 37.5,19.81 | v16.41,12.19 16.92,12.19 | v26.07,12.7 26.32,12.7 | v46.64,67.56 46.89,67.56 | v35.72,62.48 35.72,62.74 | v20.22,35.56 19.97,35.56 | v27.84,35.56 27.59,35.81 | v27.84,39.62 27.59,39.88 | v24.8,41.4 24.54,41.66 | v20.73,45.21 20.48,45.47 | v18.45,47.24 18.45,46.99 | v14.38,43.94 14.89,43.94 | v11.84,41.15 12.1,41.4 | v10.32,39.12 10.57,39.37 10.83,39.37
  Bottom 0.406: CART1.B 12.35,3.77
  Bottom 0.762: 12.35,3.77 12.35,10.16
  other vias: 18.45,40.13 18.45,37.59 17.18,38.86 19.72,38.86
  pour Bottom: 7.27,10.16 47.27,10.16 47.27,21.59 54.26,28.57 54.26,70.48 0.28,70.48 0.28,28.57 7.27,21.59
JTAGEN
  Top 0.254: U$5.15 8.6,31.5 8.29,31.5 2.95,36.83 2.95,50.55 7.52,55.12 7.52,57.15 JP1.8 8.03,58.42 10.32,60.71 R5.2
N$1
  Top 0.254: CART1.1 9.77,12.15 10.13,12.51 U$1.11
N$2  (via drill 0.6)
  Top 0.254: v10.83,8.64 10.83,8.89 | U$1.12 10.76,8.7
  Top 0.305: 10.76,8.7 v10.83,8.64
  Bottom 0.254: 9.77,7.58 v10.83,8.64
  Bottom 0.305: CART1.A 9.77,7.58
N$3
  Top 0.254: U$1.13 11.4,9.84 12.35,8.89 12.35,3.85
  Top 0.305: 12.35,3.85 CART1.2
N$4
  Top 0.254: U$1.14 12.03,10.99 14.64,8.38 14.64,3.9
  Top 0.305: 14.64,3.9 CART1.3
N$5  (via drill 0.6)
  Top 0.254: v15.91,8.64 12.67,11.87 U$1.15
  Bottom 0.254: 14.77,7.5 v15.91,8.64
  Bottom 0.305: CART1.C 14.77,7.5
N$6
  Top 0.254: CART1.4 17.27,8.8 16.16,9.91 15.4,9.91 13.3,12 U$1.16
N$7  (via drill 0.6)
  Top 0.254: v18.45,8.64 18.45,8.89 16.92,10.41 15.65,10.41 13.94,12.13 U$1.17
  Bottom 0.254: 17.27,7.46 v18.45,8.64
  Bottom 0.305: CART1.D 17.27,7.46
N$8
  Top 0.254: U$1.18 14.57,12.25 15.91,10.92 17.94,10.92 19.72,9.14 19.72,3.82
  Top 0.305: 19.72,3.82 CART1.5
N$9  (via drill 0.6)
  Top 0.254: v20.73,8.64 20.73,9.14 19.65,10.22 U$2.11
  Bottom 0.254: 19.77,7.67 v20.73,8.64
  Bottom 0.305: CART1.E 19.77,7.67
N$10
  Top 0.254: CART1.6 22.27,8.62 20.29,10.6 U$2.12
N$11  (via drill 0.6)
  Top 0.254: v23.27,8.64 20.92,10.99 U$2.13
  Bottom 0.254: 22.27,7.63 v23.27,8.64
  Bottom 0.305: CART1.F 22.27,7.63
N$12
  Top 0.254: CART1.7 24.77,8.66 23.78,9.65 23.02,9.65 21.56,11.11 U$2.14
N$13  (via drill 0.6)
  Top 0.254: v25.81,8.64 24.29,10.16 23.27,10.16 22.19,11.24 U$2.15
  Bottom 0.254: 24.77,7.59 v25.81,8.64
  Bottom 0.305: CART1.H 24.77,7.59
N$14
  Top 0.254: CART1.8 27.27,8.7 25.3,10.67 23.53,10.67 22.83,11.37 U$2.16
N$15  (via drill 0.6)
  Top 0.254: v28.35,8.64 28.35,8.89 26.07,11.18 24.03,11.18 23.46,11.75 U$2.17
  Bottom 0.254: 27.27,7.55 v28.35,8.64
  Bottom 0.305: CART1.J 27.27,7.55
N$16
  Top 0.254: CART1.9 29.77,8.74 26.83,11.68 24.8,11.68 24.1,12.38 U$2.18
N$17  (via drill 0.6)
  Top 0.254: v30.89,8.64 29.18,10.35 U$3.11
  Bottom 0.254: CART1.K 29.77,7.51 v30.89,8.64
N$18
  Top 0.254: CART1.10 32.27,8.78 31.53,9.52 31.4,9.65 29.81,11.24 U$3.12
N$19  (via drill 0.6)
  Top 0.254: v33.43,8.64 30.45,11.62 U$3.13
  Bottom 0.254: CART1.L 32.27,7.47 v33.43,8.64
N$20
  Top 0.254: CART1.11 34.77,8.82 33.69,9.91 32.92,9.91 31.08,11.75 U$3.14
N$21  (via drill 0.6)
  Top 0.254: v35.97,8.64 34.19,10.41 33.18,10.41 31.72,11.87 U$3.15
  Bottom 0.254: CART1.M 34.77,7.43 v35.97,8.64
N$22
  Top 0.254: CART1.12 37.27,8.86 35.97,10.16 35.21,10.16 34.45,10.92 33.69,10.92 32.35,12.25 U$3.16
N$23  (via drill 0.6)
  Top 0.254: v38.26,8.64 36.23,10.67 35.46,10.67 34.7,11.43 33.94,11.43 32.99,12.38 U$3.17
  Bottom 0.254: CART1.N 37.27,7.65 v38.26,8.64
N$24  (via drill 0.6)
  Top 0.254: v38.26,10.16 36.99,11.43 35.46,11.43 34.7,12.19 34.19,12.19 33.62,12.76 U$3.18
  Bottom 0.254: CART1.P 39.77,8.65 v38.26,10.16
N$25
  Top 0.254: CART1.14 42.27,8.94 38.77,12.45 38.77,13.7 U$4.11
N$26  (via drill 0.6)
  Top 0.254: U$4.12 39.34,12.64 v43.34,8.64
  Bottom 0.254: CART1.R 42.27,7.57 v43.34,8.64
N$27
  Top 0.254: CART1.15 44.77,8.73 43.59,9.91 42.83,9.91 39.97,12.76 U$4.13
N$28  (via drill 0.6)
  Top 0.254: U$4.14 40.61,12.89 43.08,10.41 44.1,10.41 v45.88,8.64
  Bottom 0.254: CART1.S 44.77,7.53 v45.88,8.64
N$29
  Top 0.254: U$8.3 6.7,28.51 9.56,25.65 11.25,25.65 U$5.27
N$30  (via drill 0.6)
  Top 0.254: U$5.126 10.57,47.09 v10.57,48.77
  Bottom 0.254: v10.57,48.77 R6.2
N$31  (via drill 0.6)
  Top 0.254: U$5.138 5.24,43.94 v5.24,44.96
  Bottom 0.254: v5.24,44.96 2.7,47.5 R7.2
N$32  (via drill 0.6)
  Top 0.254: U$5.136 6.76,43.83 6.76,45.47 v7.52,46.23
  Bottom 0.254: R8.2 5.24,48.51 v7.52,46.23
N$33  (via drill 0.6)
  Top 0.254: U$5.129 8.54,47 v8.54,47.75 8.54,50.29 22.26,64.01 22.26,66.8 22.99,67.54 S1.1
  Bottom 0.254: v8.54,47.75 8.03,48.26 R9.2
N$34
  Bottom 0.254: LED1.A 18.99,58.32 R10.1
N$35  (via drill 0.6)
  Top 0.254: U$5.120 12.35,49.55 12.35,50.8 13.62,52.32 v13.62,54.1
  Bottom 0.254: v13.62,54.1 15.4,55.88 LED1.C
SD_CLK  (via drill 0.6)
  Top 0.254: v40.54,38.1 40.54,35.56 39.02,34.04 33.52,34.04 U$5.69
  Bottom 0.254: U$6.5 36.17,43.49 40.54,39.12 v40.54,38.1
SD_CS  (via drill 0.6)
  Top 0.254: v43.34,40.39 43.34,36.83 39.53,33.02 | 39.53,33.02 31.71,33.02 U$5.65 | R11.2 39.53,30.55 39.53,33.02
  Bottom 0.254: U$6.1 46.17,42.97 v43.34,40.39
SD_DI  (via drill 0.6)
  Top 0.254: v41.81,41.4 41.81,36.07 39.27,33.53 31.91,33.53 U$5.66
  Bottom 0.254: U$6.2 43.67,43.26 v41.81,41.4
SD_DO  (via drill 0.6)
  Top 0.254: v39.53,36.58 39.53,35.81 38.26,34.54 33.72,34.54 U$5.70
  Bottom 0.254: U$6.7 31.17,44.42 32.42,43.18 35.72,43.18 39.53,39.37 v39.53,36.58
TCK  (via drill 0.6)
  Top 0.254: U$5.18 9.2,29.97 8.29,29.97 1.94,36.32 1.94,53.85 v2.44,54.36 | JP1.1 6.25,68.58 R2.1
  Bottom 0.254: JP1.1 2.44,66.04 1.94,65.53 1.94,54.86 v2.44,54.36
TDI  (via drill 0.6)
  Top 0.254: U$5.19 9.4,29.46 8.03,29.46 1.43,36.07 1.43,55.37 1.94,55.88 JP1.9 | R4.2 10.32,66.04 v9.3,65.02
  Bottom 0.254: JP1.9 4.98,57.15 4.98,61.72 5.49,62.23 7.02,62.23 9.3,64.52 v9.3,65.02
TDO
  Top 0.254: U$5.20 9.6,28.96 7.78,28.96 0.92,35.81 0.92,62.99 1.43,63.5 JP1.3
TMS
  Top 0.254: U$5.16 8.8,30.99 8.03,30.99 2.44,36.58 2.44,52.32 4.98,54.86 4.98,59.69 | 4.98,59.69 JP1.5 | 4.98,59.69 7.02,59.69 10.83,63.5 R3.2

### Text on the board
tNames: GND | +5V
bNames: XL/XE Multicart / Electrotrains '15